# Altium project ESP8266_V1.0.PrjPcb
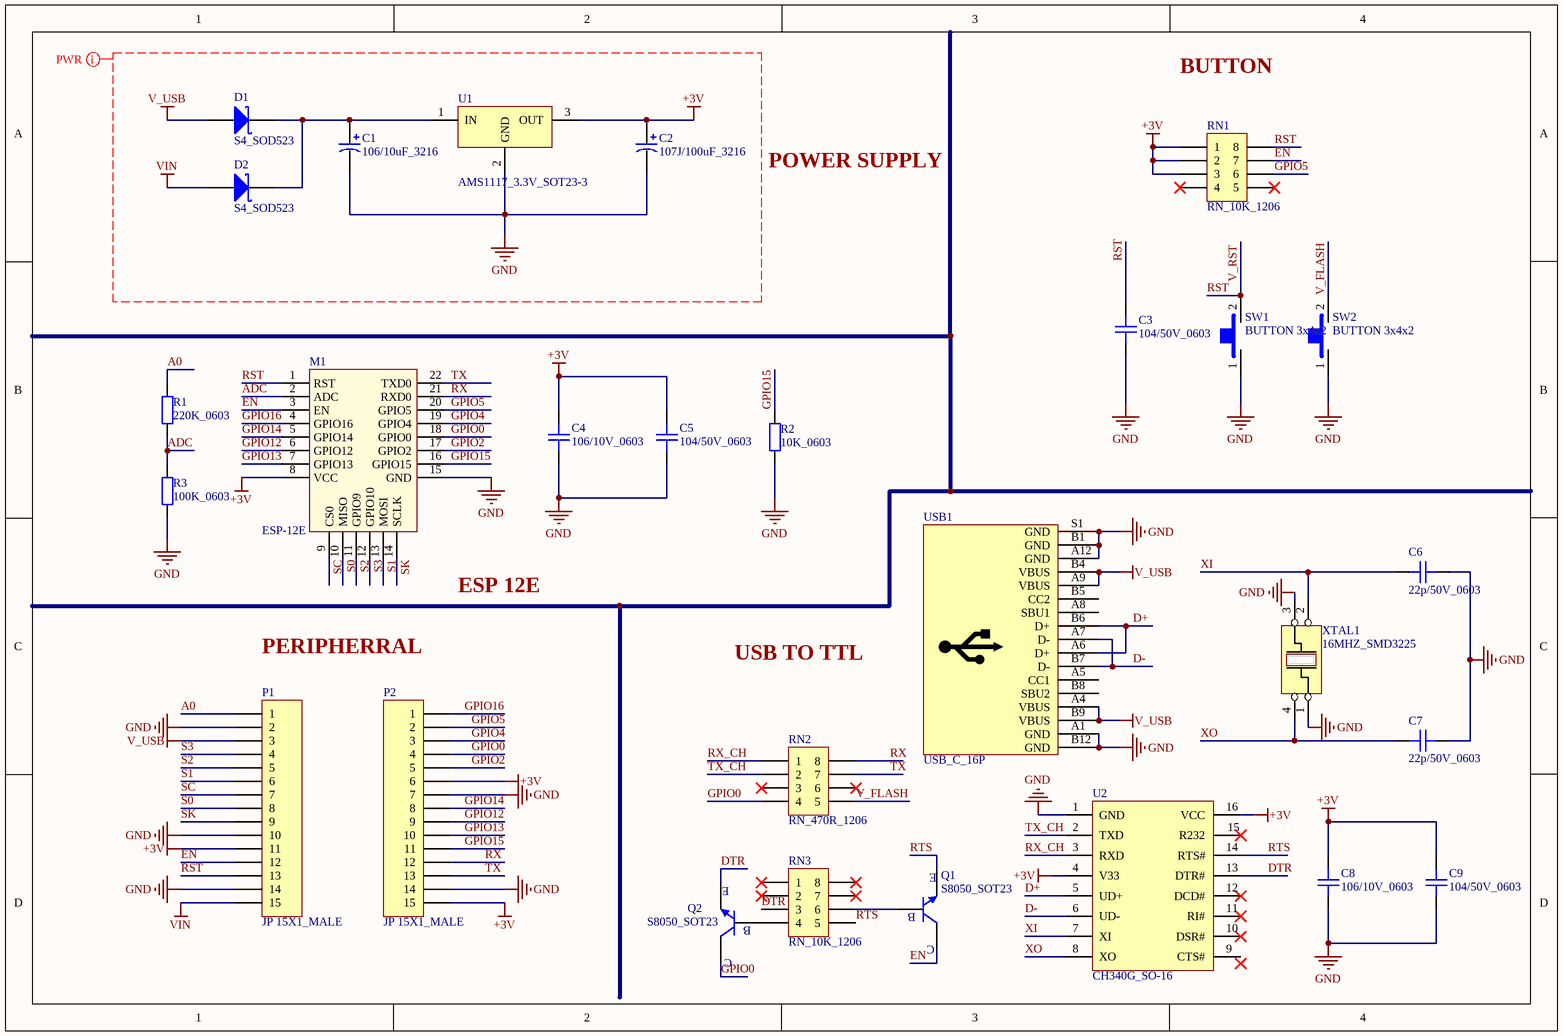
[diagram p0: ESP8266_V1.0.SchDoc]
1 sheet, 28 parts. Net scope: global (net labels, ports and power ports of the same name join across sheets).
Board file: ESP8266_V1.0.PcbDoc

## Sheet ESP8266_V1.0.SchDoc
size A4; SheetNumber: 1; SheetTotal: 1

### Parts
C1  106/10uF_3216  [RESC TANTALUM- 1206 (3216)]
C2  107J/100uF_3216  [RESC TANTALUM- 1206 (3216)]
C3  104/50V_0603  [CAP - 0603 (1608)]
C4  106/10V_0603  [CAP - 0603 (1608)]
C5  104/50V_0603  [CAP - 0603 (1608)]
C6  22p/50V_0603  [CAP - 0603 (1608)]
C7  22p/50V_0603  [CAP - 0603 (1608)]
C8  106/10V_0603  [CAP - 0603 (1608)]
C9  104/50V_0603  [CAP - 0603 (1608)]
D1  S4_SOD523  [SOD 523]
D2  S4_SOD523  [SOD 523]
M1  ESP-12E  [ESP-12E&F Module]
P1  JP 15X1_MALE  [JP 2.54 15P]
P2  JP 15X1_MALE  [JP 2.54 15P]
Q1  S8050_SOT23  [SOT23- C1815]
Q2  S8050_SOT23  [SOT23- C1815]
R1  220K_0603  [RESC - 0603 (1806)]
R2  10K_0603  [RESC - 0603 (1806)]
R3  100K_0603  [RESC - 0603 (1806)]
RN1  RN_10K_1206  [RES ARRAY 1206]
RN2  RN_470R_1206  [RES ARRAY 1206]
RN3  RN_10K_1206  [RES ARRAY 1206]
SW1  BUTTON 3x4x2  [BUTTON 3x4x2]
SW2  BUTTON 3x4x2  [BUTTON 3x4x2]
U1  AMS1117_3.3V_SOT23-3  [SOT 233]
U2  CH340G_SO-16  [SO-16]
USB1  USB_C_16P  [USC16P]
XTAL1  16MHZ_SMD3225  [CRYSTALL_SMD_3225]

### Nets
+3V: C2.1 C4.2 C5.2 C8.2 C9.2 M1.8(VCC) P1.11 P2.6 P2.15 RN1.1 RN1.2 RN1.3 U1.3(OUT) U2.4(V33) U2.16(VCC)
GND: C1.2 C2.2 C3.1 C4.1 C5.1 C6.1 C7.1 C8.1 C9.1 M1.15(GND) P1.2 P1.10 P1.14 P2.7 P2.14 R2.1 R3.1 SW1.1 SW2.1 U1.2(GND) U2.1(GND) USB1.A1(GND) USB1.A12(GND) USB1.B1(GND) USB1.B12(GND) USB1.S1(GND) XTAL1.1 XTAL1.3
V_USB: D1.1(A) P1.3 USB1.A4(VBUS) USB1.A9(VBUS) USB1.B4(VBUS) USB1.B9(VBUS)
VIN: D2.1(A) P1.15
A0: P1.1 R1.2
ADC: M1.2(ADC) R1.1 R3.2
D+: U2.5(UD+) USB1.A6(D+) USB1.B6(D+)
D-: U2.6(UD-) USB1.A7(D-) USB1.B7(D-)
DTR: Q2.2(E) RN3.3 U2.13(DTR#)
EN: M1.3(EN) P1.12 Q1.3(C) RN1.7
GPIO0: M1.18(GPIO0) P2.4 Q2.3(C) RN2.4
GPIO2: M1.17(GPIO2) P2.5
GPIO4: M1.19(GPIO4) P2.3
GPIO5: M1.20(GPIO5) P2.2 RN1.6
GPIO12: M1.6(GPIO12) P2.9
GPIO13: M1.7(GPIO13) P2.10
GPIO14: M1.5(GPIO14) P2.8
GPIO15: M1.16(GPIO15) P2.11 R2.2
GPIO16: M1.4(GPIO16) P2.1
RST: C3.2 M1.1(RST) P1.13 RN1.8 SW1.2  [also labelled V_RST]
RTS: Q1.2(E) RN3.5 U2.14(RTS#)
RX: M1.21(RXD0) P2.12 RN2.8
RX_CH: RN2.1 U2.3(RXD)
S0: M1.10(MISO) P1.8
S1: M1.13(MOSI) P1.6
S2: M1.11(GPIO9) P1.5
S3: M1.12(GPIO10) P1.4
SC: M1.9(CS0) P1.7
SK: M1.14(SCLK) P1.9
TX: M1.22(TXD0) P2.13 RN2.7
TX_CH: RN2.2 U2.2(TXD)
V_FLASH: RN2.5 SW2.2
XI: C6.2 U2.7(XI) XTAL1.2
XO: C7.2 U2.8(XO) XTAL1.4
NetC1_1: C1.1 D1.2(K) D2.2(K) U1.1(IN)
NetQ1_1: Q1.1(B) RN3.6
NetQ2_1: Q2.1(B) RN3.4

Not connected (* = marked no-connect by the designer): RN1 4* 5*; RN2 3* 6*; RN3 1* 2* 7* 8*; U2 9(CTS#) 10(DSR#)* 11(RI#)* 12(DCD#)* 15(R232)*; USB1 A5(CC1) A8(SBU1) B5(CC2) B8(SBU2)

### Layout directives
net class PWR: +3V, GND, V_USB, VIN

### Notes on the sheet
- BUTTON
- POWER SUPPLY
- PERIPHERRAL
- ESP 12E
- USB TO TTL

### Library data of the parts
C1 = TANTALUM_3216_106C: TAN_3216_106C _10UF_16V
C2 = TANTALUM_3216_107J: TAN_3216_107J _100UF_16V
C3 C5 C9 = C0603C104K5RACTU: CAP CER 0.1uF 50V 10% X7R 0603; Solder: SMT; MPN: C0603C104K5RACTU; CMT: 104/50V; Category: CAPACITOR; PinCount: 2
C4 C8 = CL10A106KP8NNNC: CAP CER 10uF 10% 10V X5R 0603; Solder: SMT; MPN: CL10A106KP8NNNC; CMT: 106/10V; Category: CAPACITOR; PinCount: 2
C6 C7 = CL10C220JB8NNNC: CAP CER 22pF 5% 50V C0G/NP0 0603; MPN: CL10C200JB8NNNC; Solder: SMT; CMT: 20p/50V/SMD; Category: CAPACITOR; PinCount: 2
D1 D2 = 1N5819HW_S4_SOD523: 1N5819HW_S4_SOD523_DIODE SCHOTTKY_1A 40V
M1 = ESP-12E: ESP-12E Module; MFR: Espressif; Solder: SMT; Category: MODULE; MPN: ESP-12E; PinCount: 22; Value: ESP-12E
P1 P2 = JP 15x1: JUMP_MALE_15 Pin Pitch 2.54mm; MPN: S1012EC-40-ND; Solder: WAVE
Q1 Q2 = S8050: TRANS_NPN_0.5A_SOT23-3
R1 = RC0603FR-07220KL: RES SMD 220K OHM 1% 1/10W 0603; Solder: SMT; MPN: RC0603FR-07220KL; CMT: 220K; Category: RESISTOR
R2 = RC0603FR-0710KL: RES SMD 10K OHM 1% 1/10W 0603; CompanyID: VT00464; Solder: SMT; MPN: RC0603FR-0710KL; CMT: 10K; Category: RESISTOR
R3 = RC0603FR-07100KL: RES SMD 100K OHM 1% 1/10W 0603; Solder: SMT; MPN: RC0603FR-07100KL; CMT: 100K; Category: RESISTOR
RN1 RN3 = CHIP ARRAY RESISTOR 10K 1206
RN2 = CHIP ARRAY RESISTOR: CHIP ARRAY RESISTOR 470R 1206
U1 = AMS1117-3.3
U2 = CH340G: USB<->UART
USB1 = USB_C_16P: MF: Valcon; MP: CSP-USC16-TR; SnapEDA_Link: https://www.snapeda.com/parts/CSP-USC16-TR/Valcon/view-part/?ref=snap; Availability: In Stock; Price: None; Value: *; Check_prices: https://www.snapeda.com/parts/CSP-USC16-TR/Valcon/view-part/?ref=eda; Package: None; Purchase-URL: https://pricing.snapeda.com/search/part/CSP-USC16-TR/?ref=eda
XTAL1 = 16MHZ: CRYSTAL 16MHZ_SMD3225; MPN: ABM8G-25.000MHZ-18-D2Y-T; MFR: Abracon LLC; Solder: SMT; CMT: 25MHz; Category: CRYSTAL